# EasyEDA Pro project Smart Water Meter.eprj

# Schematic Schematic1
Board Name: Board1; Create Date: 2025-05-09; Page Name: P1; Project Name: Smart Water Meter; Schematic Name: Schematic1; Update Date: 2025-05-09; Company: EasyEDA.com; Page Size: A4; Version: V1.0
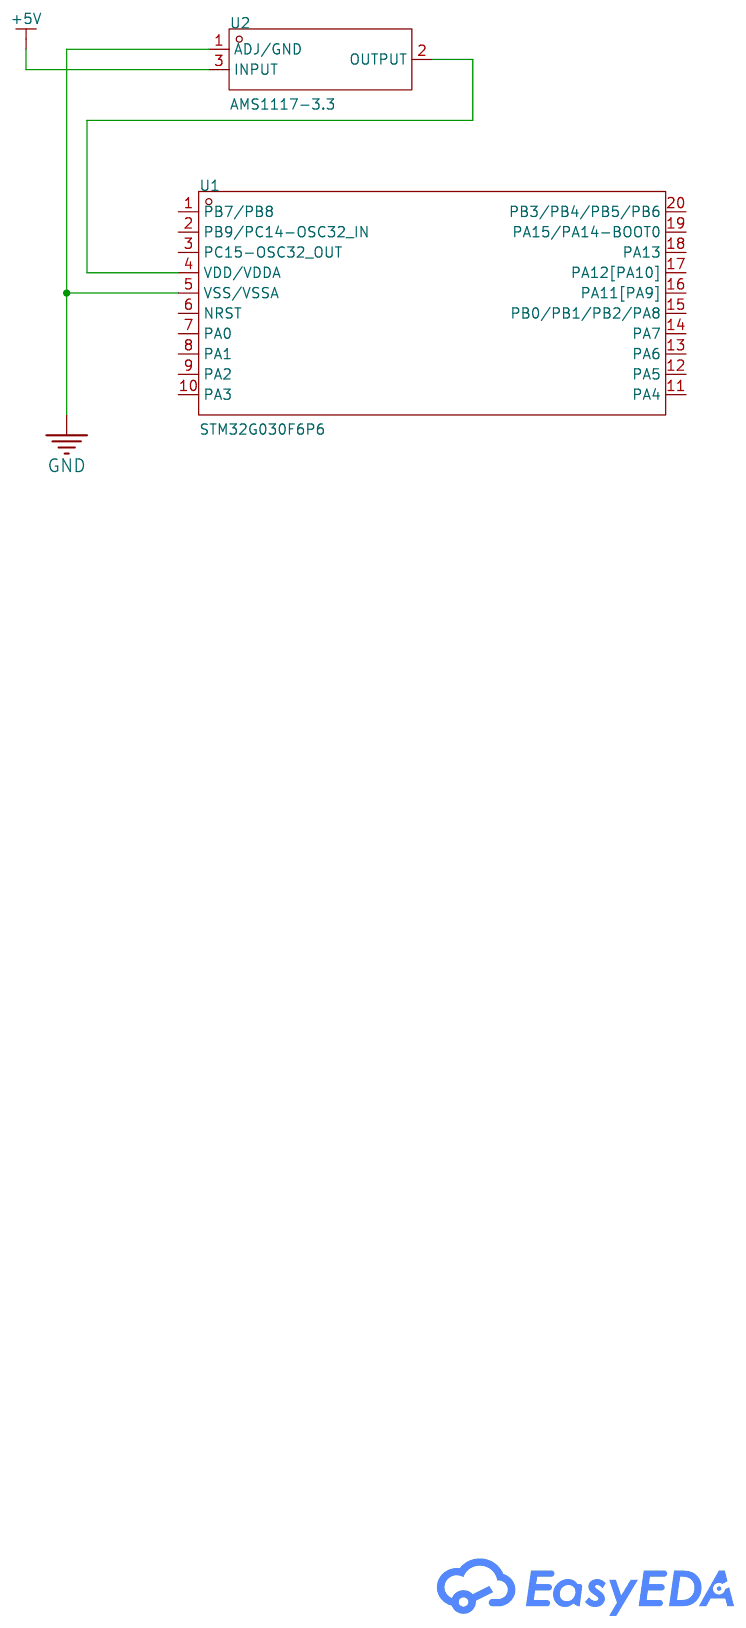
[diagram p0: schematic sheet]

## Parts
U1  STM32G030F6P6  [TSSOP-20_L6.5-W4.4-P0.65-LS6.4-BL]
U2  AMS1117-3.3  [TO-252-2_L6.6-W5.6-P2.3-LS9.7]

## Library data of the parts
U1 = STM32G030F6P6: LCSC Part Name: 主流超值系列Arm Cortex-M0+ MCU，具有32 KB Flash存储器、8 KB RAM、64 MHz CPU、2x USART、定时器、ADC和通信接口，2-3.6V; Supplier Part: C724040; Manufacturer: ST(意法半导体); Supplier Footprint: TSSOP-20; JLCPCB Part Class: Extended Part; Datasheet: https://atta.szlcsc.com/upload/public/pdf/source/20200511/C529329_A1CB615556C746C4EA827FCAD1461480.pdf; Supplier: LCSC; CPU Core: ARM-M0; CPU Maximum Speed: 64MHz; Program Storage Size: 32KB; Program Memory Type: FLASH; Number of I/O: 18; ADC (Bit): 12bit; Low Voltage Detection Threshold: 2V~3.6V
U2 = AMS1117-3.3_C41414107: Supplier Part: C41414107; Manufacturer: YONGYUTAI(永裕泰); Supplier Footprint: TO-252; JLCPCB Part Class: Extended Part; Datasheet: https://atta.szlcsc.com/upload/public/pdf/source/20240925/369679C975B69C96F60E7CB3A7B1473C.pdf; Supplier: LCSC; Output Type: Fixed; Voltage - Supply: 15V; Output Voltage: 3.3V; Output Current: 800mA; Power Supply Rejection Ratio (PSRR): 75dB@(120Hz); Voltage Dropout: 1.2V; Operating Temperature: -40℃~+125℃; Output Configuration: Positive electrode; Number of Outputs: 1

## Nets
+5V: U2.3(INPUT)
GND: U1.5(VSS/VSSA) U2.1(ADJ/GND)
Net-(U1-4): U1.4(VDD/VDDA) U2.2(OUTPUT)

Not connected (* = marked no-connect by the designer): U1 1(PB7/PB8) 2(PB9/PC14-OSC32_IN) 3(PC15-OSC32_OUT) 6(NRST) 7(PA0) 8(PA1) 9(PA2) 10(PA3) 11(PA4) 12(PA5) 13(PA6) 14(PA7) 15(PB0/PB1/PB2/PA8) 16(PA11[PA9]) 17(PA12[PA10]) 18(PA13) 19(PA15/PA14-BOOT0) 20(PB3/PB4/PB5/PB6)
